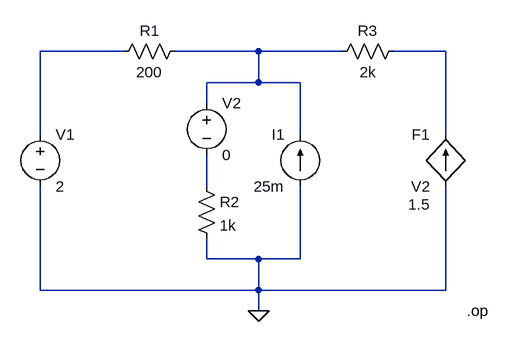
[diagram p0: schematic circuit.asc]
circuit.asc, the LTspice schematic file:
Version 4.1
SHEET 1 880 680
WIRE 224 0 96 0
WIRE 432 0 304 0
WIRE 560 0 432 0
WIRE 720 0 640 0
WIRE 432 48 432 0
WIRE 432 48 352 48
WIRE 496 48 432 48
WIRE 352 80 352 48
WIRE 96 128 96 0
WIRE 496 128 496 48
WIRE 720 128 720 0
WIRE 352 208 352 160
WIRE 352 320 352 288
WIRE 432 320 352 320
WIRE 496 320 496 208
WIRE 496 320 432 320
WIRE 96 368 96 208
WIRE 432 368 432 320
WIRE 432 368 96 368
WIRE 720 368 720 208
WIRE 720 368 432 368
WIRE 432 400 432 368
FLAG 432 400 0
SYMBOL voltage 96 112 R0
WINDOW 123 0 0 Left 0
WINDOW 39 0 0 Left 0
SYMATTR InstName V1
SYMATTR Value 2
SYMBOL res 320 -16 R90
WINDOW 0 0 56 VBottom 2
WINDOW 3 32 56 VTop 2
SYMATTR InstName R1
SYMATTR Value 200
SYMBOL res 656 -16 R90
WINDOW 0 0 56 VBottom 2
WINDOW 3 32 56 VTop 2
SYMATTR InstName R3
SYMATTR Value 2k
SYMBOL voltage 352 64 R0
WINDOW 123 0 0 Left 0
WINDOW 39 0 0 Left 0
SYMATTR InstName V2
SYMATTR Value 0
SYMBOL res 336 192 R0
SYMATTR InstName R2
SYMATTR Value 1k
SYMBOL lib\\sym\\current 496 208 R180
WINDOW 0 24 80 Left 2
WINDOW 3 24 0 Left 2
WINDOW 123 0 0 Left 0
WINDOW 39 0 0 Left 0
SYMATTR InstName I1
SYMATTR Value 25m
SYMBOL lib\\sym\\f 720 208 R180
WINDOW 0 24 80 Left 2
WINDOW 3 24 0 Left 2
WINDOW 123 24 -28 Left 2
SYMATTR InstName F1
SYMATTR Value V2
SYMATTR Value2 1.5
TEXT 752 400 Left 2 !.op

The netlist it stands for:
* circuit.asc
V1 N001 0 2
R1 N002 N001 200
R3 N003 N002 2k
V2 N002 N004 0
R2 N004 0 1k
I1 0 N002 25m
F1 0 N003 V2 1.5
.op
.backanno
.end